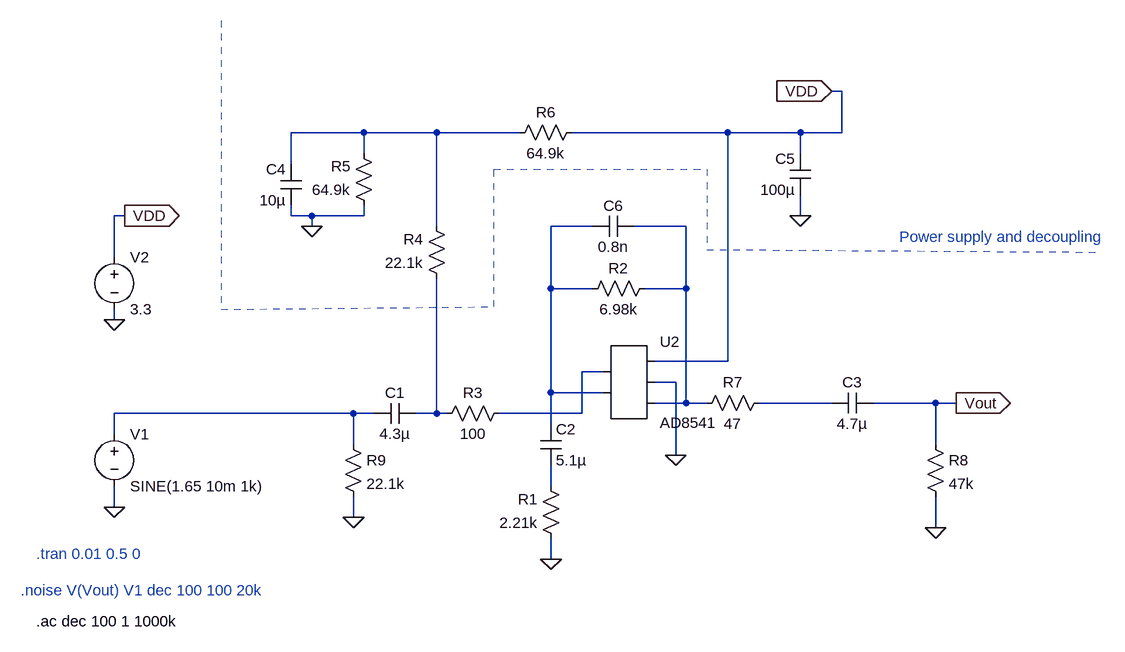
[diagram p0: schematic ACE_mic_amp.asc]
ACE_mic_amp.asc, the LTspice schematic file:
Version 4
SHEET 1 1108 800
WIRE 704 -160 688 -160
WIRE -32 -96 -144 -96
WIRE 80 -96 -32 -96
WIRE 208 -96 80 -96
WIRE 528 -96 288 -96
WIRE 640 -96 528 -96
WIRE 704 -96 704 -160
WIRE 704 -96 640 -96
WIRE -32 -64 -32 -96
WIRE 640 -64 640 -96
WIRE -144 -48 -144 -96
WIRE -400 32 -416 32
WIRE -144 32 -144 16
WIRE -112 32 -144 32
WIRE -32 32 -32 16
WIRE -32 32 -112 32
WIRE 640 32 640 0
WIRE -112 48 -112 32
WIRE 80 48 80 -96
WIRE 320 48 256 48
WIRE 464 48 384 48
WIRE -416 96 -416 32
WIRE 256 144 256 48
WIRE 320 144 256 144
WIRE 464 144 464 48
WIRE 464 144 400 144
WIRE -416 192 -416 176
WIRE 528 256 528 -96
WIRE 528 256 416 256
WIRE 336 272 304 272
WIRE 448 288 416 288
WIRE 256 304 256 144
WIRE 336 304 256 304
WIRE 464 320 464 144
WIRE 464 320 416 320
WIRE 496 320 464 320
WIRE 688 320 576 320
WIRE 848 320 752 320
WIRE 880 320 848 320
WIRE -48 336 -416 336
WIRE -16 336 -48 336
WIRE 80 336 80 128
WIRE 80 336 48 336
WIRE 96 336 80 336
WIRE 304 336 304 272
WIRE 304 336 176 336
WIRE 256 352 256 304
WIRE -416 368 -416 336
WIRE -48 384 -48 336
WIRE 848 384 848 320
WIRE 448 400 448 288
WIRE 256 448 256 416
WIRE -416 480 -416 448
WIRE -48 496 -48 464
WIRE 848 512 848 464
WIRE 256 560 256 528
FLAG -416 192 0
FLAG 256 560 0
FLAG -400 32 VDD
IOPIN -400 32 Out
FLAG -48 496 0
FLAG 848 512 0
FLAG -112 48 0
FLAG 640 32 0
FLAG 688 -160 VDD
IOPIN 688 -160 In
FLAG 448 400 0
FLAG -416 480 0
FLAG 880 320 Vout
IOPIN 880 320 Out
SYMBOL res 272 544 R180
WINDOW 0 36 76 Left 2
WINDOW 3 36 40 Left 2
SYMATTR InstName R1
SYMATTR Value 2.21k
SYMBOL res 304 160 R270
WINDOW 0 32 56 VTop 2
WINDOW 3 0 56 VBottom 2
SYMATTR InstName R2
SYMATTR Value 6.98k
SYMBOL voltage -416 80 R0
SYMATTR InstName V2
SYMATTR Value 3.3
SYMBOL res 192 320 R90
WINDOW 0 0 56 VBottom 2
WINDOW 3 32 56 VTop 2
SYMATTR InstName R3
SYMATTR Value 100
SYMBOL res 96 144 R180
WINDOW 0 36 76 Left 2
WINDOW 3 36 40 Left 2
SYMATTR InstName R4
SYMATTR Value 22.1k
SYMBOL res -16 32 R180
WINDOW 0 36 76 Left 2
WINDOW 3 36 40 Left 2
SYMATTR InstName R5
SYMATTR Value 64.9k
SYMBOL res 192 -80 R270
WINDOW 0 32 56 VTop 2
WINDOW 3 0 56 VBottom 2
SYMATTR InstName R6
SYMATTR Value 64.9k
SYMBOL res 480 336 R270
WINDOW 0 32 56 VTop 2
WINDOW 3 0 56 VBottom 2
SYMATTR InstName R7
SYMATTR Value 47
SYMBOL res 832 368 R0
SYMATTR InstName R8
SYMATTR Value 47k
SYMBOL res -64 368 R0
SYMATTR InstName R9
SYMATTR Value 22.1k
SYMBOL cap 752 304 R90
WINDOW 0 0 32 VBottom 2
WINDOW 3 32 32 VTop 2
SYMATTR InstName C3
SYMATTR Value 4.7µ
SYMBOL cap -128 16 R180
WINDOW 0 24 56 Left 2
WINDOW 3 24 8 Left 2
SYMATTR InstName C4
SYMATTR Value 10µ
SYMBOL cap 656 0 R180
WINDOW 0 24 56 Left 2
WINDOW 3 24 8 Left 2
SYMATTR InstName C5
SYMATTR Value 100µ
SYMBOL cap 240 352 R0
SYMATTR InstName C2
SYMATTR Value 5.1µ
SYMBOL voltage -416 352 R0
SYMATTR InstName V1
SYMATTR Value SINE(1.65 10m 1k)
SYMATTR SpiceLine Rser=400
SYMATTR Value2 AC 1
SYMBOL AutoGenerated/AD8541 368 288 R0
SYMATTR InstName U2
SYMBOL cap 48 320 R90
WINDOW 0 0 32 VBottom 2
WINDOW 3 32 32 VTop 2
SYMATTR InstName C1
SYMATTR Value 4.3µ
SYMBOL cap 384 32 R90
WINDOW 0 0 32 VBottom 2
WINDOW 3 32 32 VTop 2
SYMATTR InstName C6
SYMATTR Value 0.8n
TEXT -560 608 Left 2 ;.noise V(Vout) V1 dec 100 100 20k
TEXT -536 552 Left 2 ;.tran 0.01 0.5 0
TEXT -536 656 Left 2 !.ac dec 100 1 1000k
TEXT 792 64 Left 2 ;Power supply and decoupling
LINE Normal -252 -268 -252 176 2
LINE Normal -252 176 168 172 2
LINE Normal 168 172 168 -28 2
LINE Normal 168 -28 168 -40 2
LINE Normal 168 -40 496 -40 2
LINE Normal 496 -40 496 84 2
LINE Normal 496 84 1104 88 2

The netlist it stands for:
* ACE_mic_amp.asc
R1 0 N008 2.21k
R2 N002 N003 6.98k
V2 VDD 0 3.3
R3 N004 N007 100
R4 N007 N001 22.1k
R5 0 N001 64.9k
R6 N001 VDD 64.9k
R7 N003 N005 47
R8 Vout 0 47k
R9 N006 0 22.1k
C3 Vout N005 4.7µ
C4 0 N001 10µ
C5 0 VDD 100µ
C2 N002 N008 5.1µ
V1 N006 0 SINE(1.65 10m 1k) AC 1 Rser=400
* U2: AD8541 (symbol AutoGenerated/AD8541 not available, pins judged from their places): pin1=N004 pin2=N002 pin3=VDD pin4=0 pin5=N003
C1 N007 N006 4.3µ
C6 N003 N002 0.8n
* .noise V(Vout) V1 dec 100 100 20k
* .tran 0.01 0.5 0
.ac dec 100 1 1000k
* Power supply and decoupling
.backanno
.end